# EAGLE design GBM8-1500 (EAGLE 5.10)
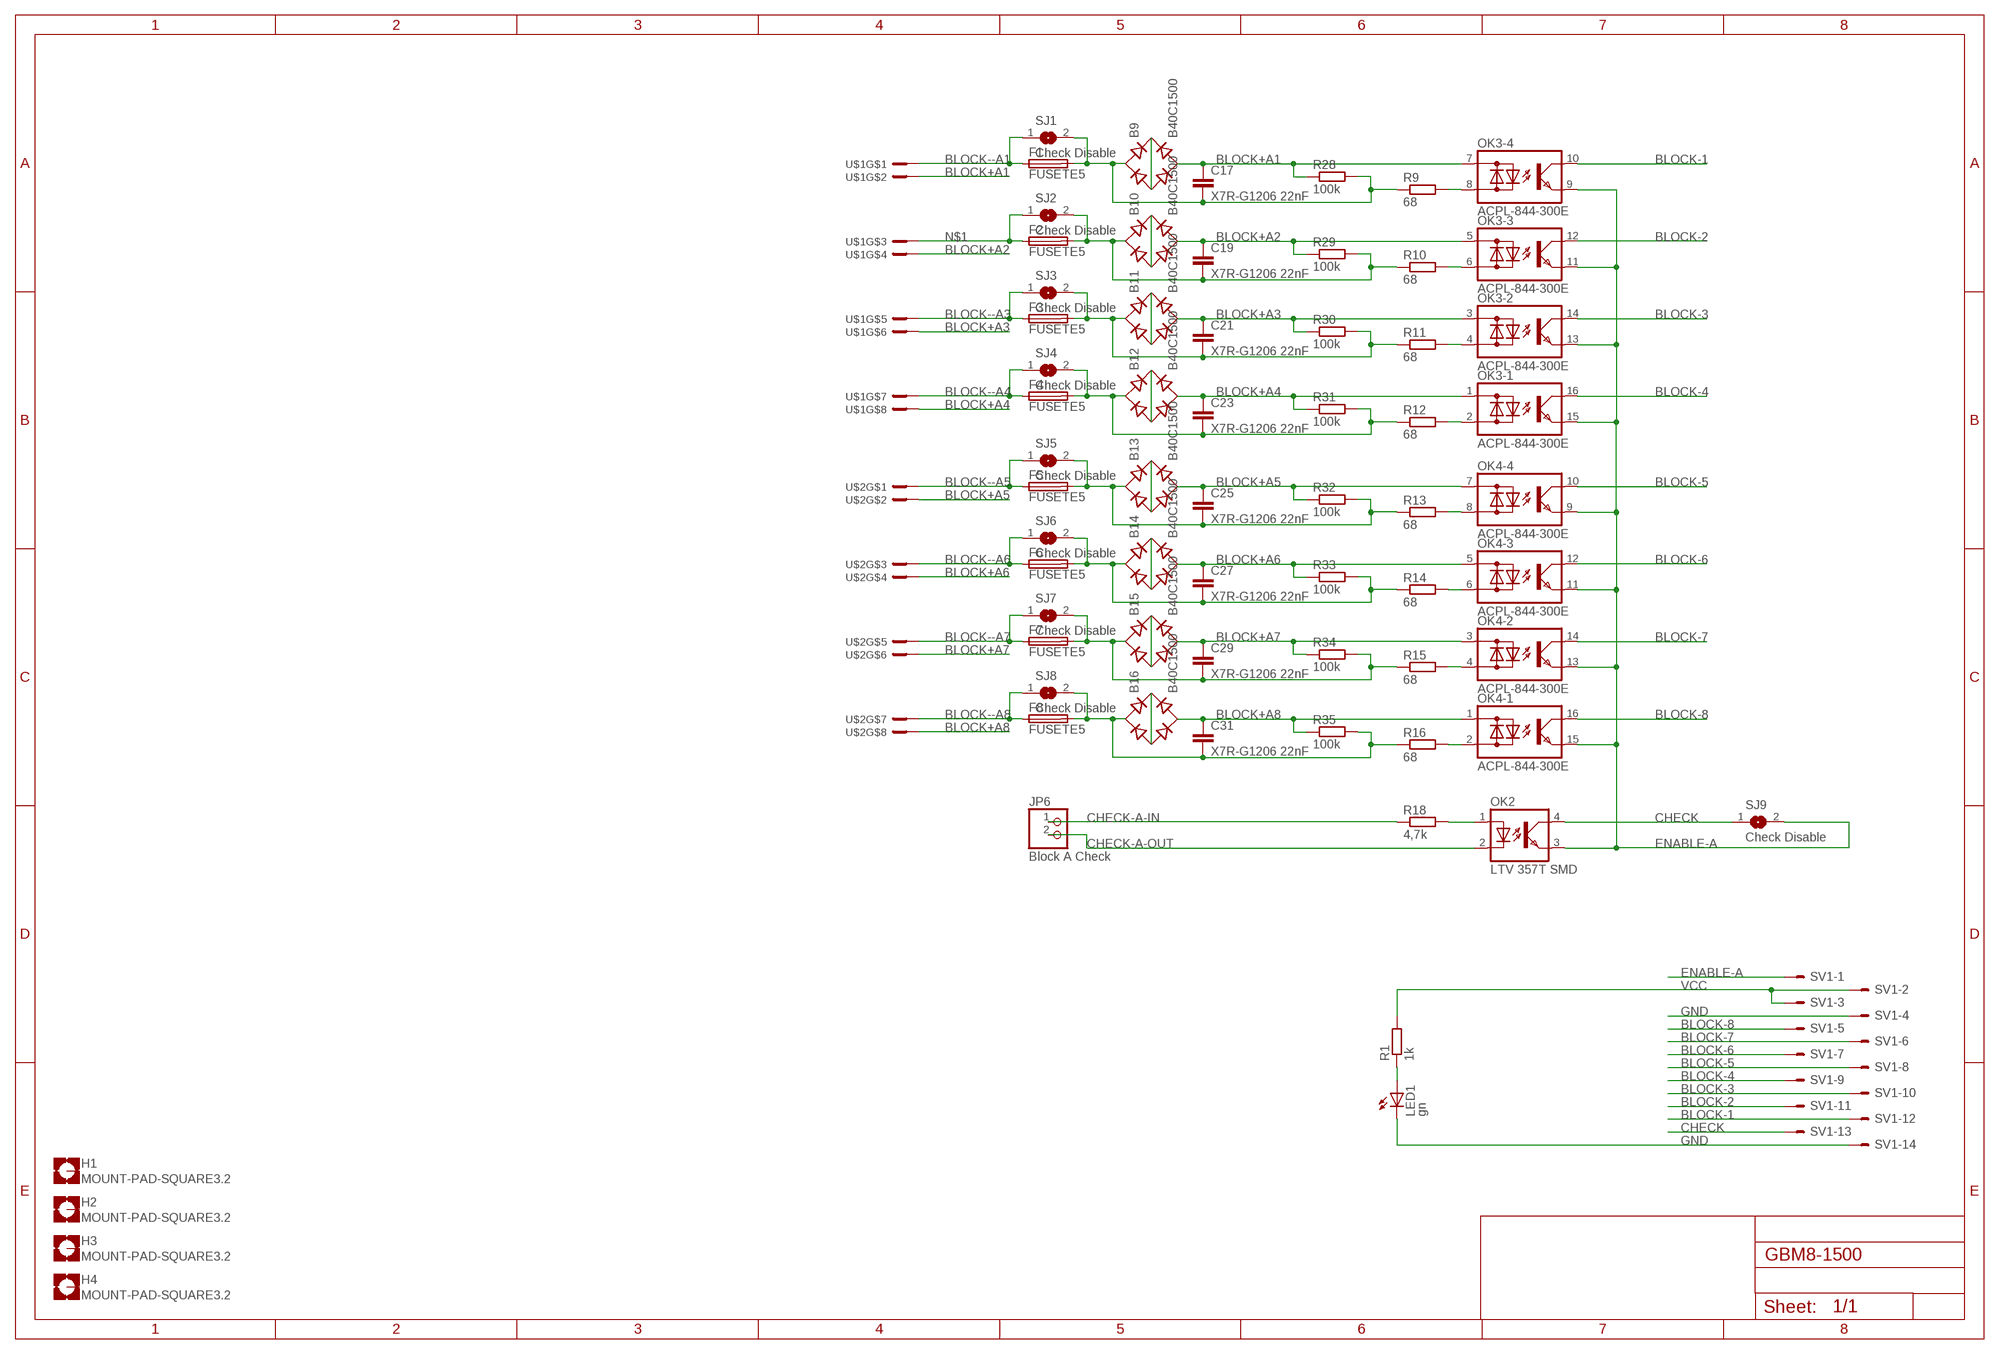
[diagram p0: schematic, sheet 1]

## Parts
B9  B40C1500  RB1A  [RB1A]
B10  B40C1500  RB1A  [RB1A]
B11  B40C1500  RB1A  [RB1A]
B12  B40C1500  RB1A  [RB1A]
B13  B40C1500  RB1A  [RB1A]
B14  B40C1500  RB1A  [RB1A]
B15  B40C1500  RB1A  [RB1A]
B16  B40C1500  RB1A  [RB1A]
C17  X7R-G1206 22nF  C-EUC1206  [C1206]
C19  X7R-G1206 22nF  C-EUC1206  [C1206]
C21  X7R-G1206 22nF  C-EUC1206  [C1206]
C23  X7R-G1206 22nF  C-EUC1206  [C1206]
C25  X7R-G1206 22nF  C-EUC1206  [C1206]
C27  X7R-G1206 22nF  C-EUC1206  [C1206]
C29  X7R-G1206 22nF  C-EUC1206  [C1206]
C31  X7R-G1206 22nF  C-EUC1206  [C1206]
F1  FUSETE5  [TE5]
F2  FUSETE5  [TE5]
F3  FUSETE5  [TE5]
F4  FUSETE5  [TE5]
F5  FUSETE5  [TE5]
F6  FUSETE5  [TE5]
F7  FUSETE5  [TE5]
F8  FUSETE5  [TE5]
H1  MOUNT-PAD-SQUARE3.2  [3,2-PAD-SQUARE]
H2  MOUNT-PAD-SQUARE3.2  [3,2-PAD-SQUARE]
H3  MOUNT-PAD-SQUARE3.2  [3,2-PAD-SQUARE]
H4  MOUNT-PAD-SQUARE3.2  [3,2-PAD-SQUARE]
JP6  Block A Check  PINHD-1X2  [1X02]
LED1  gn  LEDCHIPLED_1206  [CHIPLED_1206]
OK2  LTV 357T SMD  LTV816S  [SMD4]
OK3  ACPL-844-300E  [DIP16]
OK4  ACPL-844-300E  [DIP16]
R1  1k  R-EU_R0603  [R0603]
R9  68  R-EU_R1206  [R1206]
R10  68  R-EU_R1206  [R1206]
R11  68  R-EU_R1206  [R1206]
R12  68  R-EU_R1206  [R1206]
R13  68  R-EU_R1206  [R1206]
R14  68  R-EU_R1206  [R1206]
R15  68  R-EU_R1206  [R1206]
R16  68  R-EU_R1206  [R1206]
R18  4,7k  R-EU_R1206  [R1206]
R28  100k  R-EU_M0805  [M0805]
R29  100k  R-EU_M0805  [M0805]
R30  100k  R-EU_M0805  [M0805]
R31  100k  R-EU_M0805  [M0805]
R32  100k  R-EU_R0805  [R0805]
R33  100k  R-EU_M0805  [M0805]
R34  100k  R-EU_M0805  [M0805]
R35  100k  R-EU_M0805  [M0805]
SJ1  Check Disable  SJ  [SJ]
SJ2  Check Disable  SJ  [SJ]
SJ3  Check Disable  SJ  [SJ]
SJ4  Check Disable  SJ  [SJ]
SJ5  Check Disable  SJ  [SJ]
SJ6  Check Disable  SJ  [SJ]
SJ7  Check Disable  SJ  [SJ]
SJ8  Check Disable  SJ  [SJ]
SJ9  Check Disable  SJ  [SJ]
SV1  ML14E  [ML14]
U$1  AST021-08  [P_AST021-08]
U$2  AST021-08  [P_AST021-08]

## Nets
BLOCK+A1: B9.AC2 C17.1 OK3.7(-4:AC1) R28.1 U$1.P$2
BLOCK+A2: B10.AC2 C19.1 OK3.5(-3:AC1) R29.1 U$1.P$4
BLOCK+A3: B11.AC2 C21.1 OK3.3(-2:AC1) R30.1 U$1.P$6
BLOCK+A4: B12.AC2 C23.1 OK3.1(-1:AC1) R31.1 U$1.P$8
BLOCK+A5: B13.AC2 C25.1 OK4.7(-4:AC1) R32.1 U$2.P$2
BLOCK+A6: B14.AC2 C27.1 OK4.5(-3:AC1) R33.1 U$2.P$4
BLOCK+A7: B15.AC2 C29.1 OK4.3(-2:AC1) R34.1 U$2.P$6
BLOCK+A8: B16.AC2 C31.1 OK4.1(-1:AC1) R35.1 U$2.P$8
BLOCK-1: OK3.10(-4:C) SV1.12
BLOCK-2: OK3.12(-3:C) SV1.11
BLOCK-3: OK3.14(-2:C) SV1.10
BLOCK-4: OK3.16(-1:C) SV1.9
BLOCK-5: OK4.10(-4:C) SV1.8
BLOCK-6: OK4.12(-3:C) SV1.7
BLOCK-7: OK4.14(-2:C) SV1.6
BLOCK-8: OK4.16(-1:C) SV1.5
BLOCK--A1: F1.1 SJ1.1 U$1.P$1
BLOCK--A3: F3.1 SJ3.1 U$1.P$5
BLOCK--A4: F4.1 SJ4.1 U$1.P$7
BLOCK--A5: F5.1 SJ5.1 U$2.P$1
BLOCK--A6: F6.1 SJ6.1 U$2.P$3
BLOCK--A7: F7.1 SJ7.1 U$2.P$5
BLOCK--A8: F8.1 SJ8.1 U$2.P$7
BLOCK-A1: B9.AC1 C17.2 F1.2 R9.1 R28.2 SJ1.2
BLOCK-A2: B10.AC1 C19.2 F2.2 R10.1 R29.2 SJ2.2
BLOCK-A3: B11.AC1 C21.2 F3.2 R11.1 R30.2 SJ3.2
BLOCK-A4: B12.AC1 C23.2 F4.2 R12.1 R31.2 SJ4.2
BLOCK-A5: B13.AC1 C25.2 F5.2 R13.1 R32.2 SJ5.2
BLOCK-A6: B14.AC1 C27.2 F6.2 R14.1 R33.2 SJ6.2
BLOCK-A7: B15.AC1 C29.2 F7.2 R15.1 R34.2 SJ7.2
BLOCK-A8: B16.AC1 C31.2 F8.2 R16.1 R35.2 SJ8.2
CHECK: OK2.4(COL) SJ9.1 SV1.13
CHECK-A-IN: JP6.1 R18.1
CHECK-A-OUT: JP6.2 OK2.2(C)
ENABLE-A: OK2.3(EMIT) OK3.9(-4:E) OK3.11(-3:E) OK3.13(-2:E) OK3.15(-1:E) OK4.9(-4:E) OK4.11(-3:E) OK4.13(-2:E) OK4.15(-1:E) SJ9.2 SV1.1
GND: LED1.C SV1.4 SV1.14
N$1: F2.1 SJ2.1 U$1.P$3
N$5: LED1.A R1.1
N$7: OK2.1(A) R18.2
N$21: OK3.8(-4:AC2) R9.2
N$23: OK3.6(-3:AC2) R10.2
N$26: OK3.4(-2:AC2) R11.2
N$29: OK4.6(-3:AC2) R14.2
N$32: OK3.2(-1:AC2) R12.2
N$36: OK4.4(-2:AC2) R15.2
N$41: OK4.8(-4:AC2) R13.2
N$42: OK4.2(-1:AC2) R16.2
N$44: B9.+ B9.-
N$47: B10.+ B10.-
N$55: B11.+ B11.-
N$59: B12.+ B12.-
N$65: B13.+ B13.-
N$68: B14.+ B14.-
N$76: B15.+ B15.-
N$80: B16.+ B16.-
VCC: R1.2 SV1.2 SV1.3
Unconnected: H1.B3,2(MOUNT) H2.B3,2(MOUNT) H3.B3,2(MOUNT) H4.B3,2(MOUNT)

## Library data of the parts
B9-B16 = rectifier:RB1A: RECTIFIER 1 A
C17 C19 C21 C23 C25 C27 C29 C31 = rcl:C-EU: CAPACITOR, European symbol
F1-F8 = fuse:FUSE: Fuse
H1-H4 = holes:MOUNT-PAD-SQUARE: MOUNTING PAD, square
JP6 = pinhead:PINHD-1X2: PIN HEADER
LED1 = led:LED: LED OSRAM: - CHIPLED LG R971, LG N971, LY N971, LG Q971, LY Q971, LO R971, LY R971 LH N974, LH R974 LS Q976, LO Q976, LY Q976 LO Q996 - Hyper CHIPLED LW Q18S LB Q993, LB Q99A, LB R99A - SideLED LS A670, LO A670, LY A670, LG A670, LP A670 LB A673, LV A673, LT A673, LW A673 LH A674 LY A675 LS A676, LA A676, LO A676, LY A676, LW A676 LS A679, LY A679, LG A679 - Hyper Micro SIDELED® LS Y876, LA Y876, LO Y876, LY Y876 LT Y87S - SmartLED LW L88C, LW L88S LB L89C, LB L89S, LG L890 LS L89K, LO L89K, LY L89K LS L896, LA L896, LO L896, LY L896 - TOPLED LS T670, LO T670, LY T670, LG T670, LP T670 LSG T670, LSP T670, LSY T670, LOP T670, LYG T670 LG T671, LOG T671, LSG T671 LB T673, LV T673, LT T673, LW T673 LH T674 LS T676, LA T676, LO T676, LY T676, LB T676, LH T676, LSB T676, LW T676 LB T67C, LV T67C, LT T67C, LS T67K, LO T67K, LY T67K, LW E67C LS E67B, LA E67B, LO E67B, LY E67B, LB E67C, LV E67C, LT E67C LW T67C LS T679, LY T679, LG T679 LS T770, LO T770, LY T770, LG T770, LP T770 LB T773, LV T773, LT T773, LW T773 LH T774 LS E675, LA E675, LY E675, LS T675 LS T776, LA T776, LO T776, LY T776, LB T776 LHGB T686 LT T68C, LB T68C - Hyper Mini TOPLED® LB M676 - Mini TOPLED Santana® LG M470 LS M47K, LO M47K, LY M47K Source: http://www.osram.convergy.de LUXEON: - LUMILED® LXK2-PW12-R00, LXK2-PW12-S00, LXK2-PW14-U00, LXK2-PW14-V00 LXK2-PM12-R00, LXK2-PM12-S00, LXK2-PM14-U00 LXK2-PE12-Q00, LXK2-PE12-R00, LXK2-PE12-S00, LXK2-PE14-T00, LXK2-PE14-U00 LXK2-PB12-K00, LXK2-PB12-L00, LXK2-PB12-M00, LXK2-PB14-N00, LXK2-PB14-P00, LXK2-PB14-Q00 LXK2-PR12-L00, LXK2-PR12-M00, LXK2-PR14-Q00, LXK2-PR14-R00 LXK2-PD12-Q00, LXK2-PD12-R00, LXK2-PD12-S00 LXK2-PH12-R00, LXK2-PH12-S00 LXK2-PL12-P00, LXK2-PL12-Q00, LXK2-PL12-R00 Source: www.luxeon.com KINGBRIGHT: KA-3528ASYC Source: www.kingbright.com
OK2 = optocoupler:LTV816: OPTO COUPLER Source: LITEON, LTV816.pdf
OK3 OK4 = my-optocoupler:ACPL-844-300E: FOTOTRANSISTOR/OPTOKOPPLER ACPL-844-300E Conrad Artikel-Nr.: 140222 - 62
R1 R9-R16 R18 R28-R35 = rcl:R-EU_: RESISTOR, European symbol
SJ1-SJ9 = jumper:SJ: SMD solder JUMPER
SV1 = con-ml:ML14E: HARTING
U$1 U$2 = con-ria-ast027-750:AST021-08

## Board
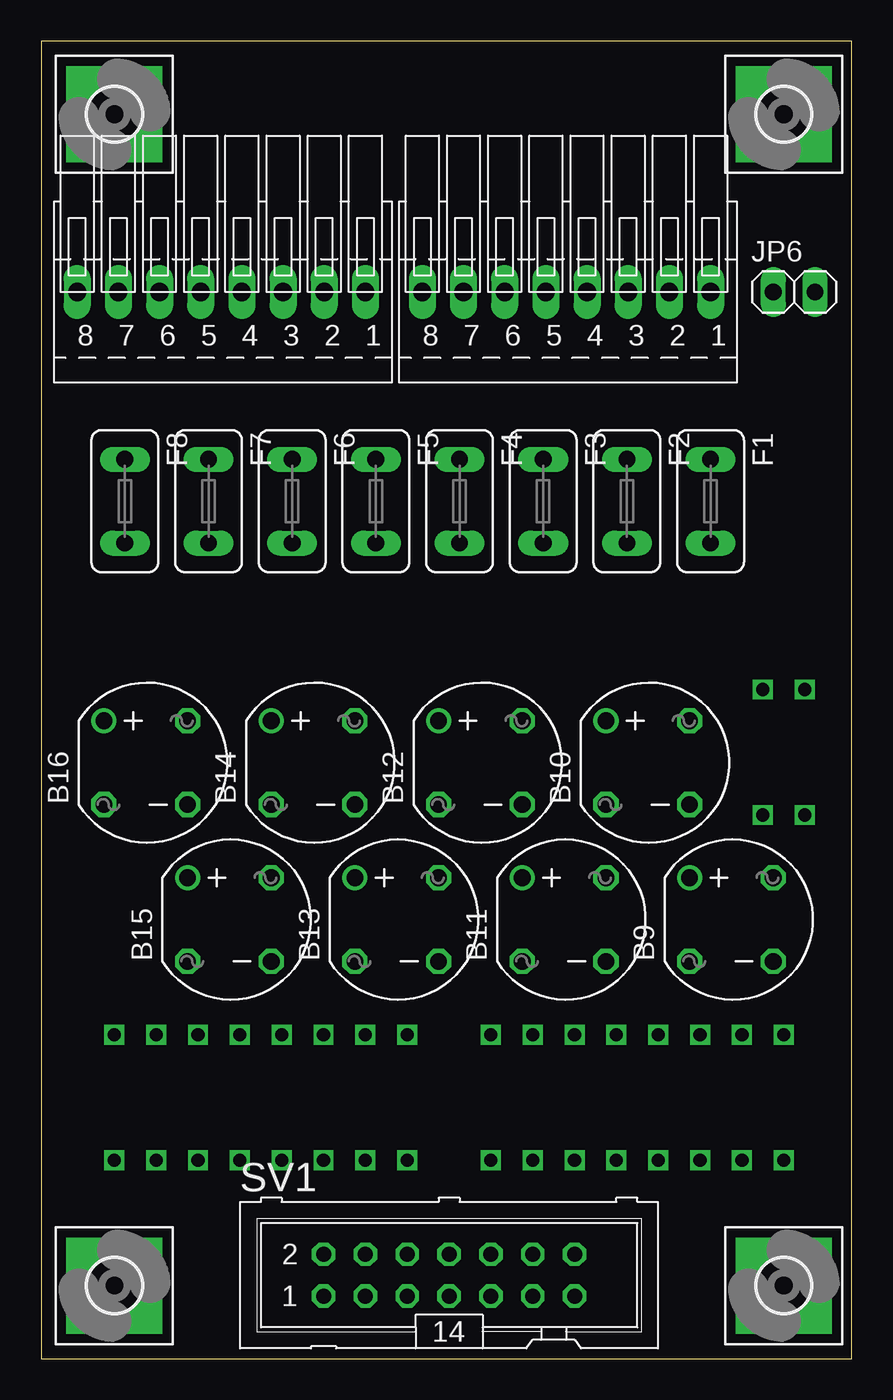
[diagram p1: board, top side]
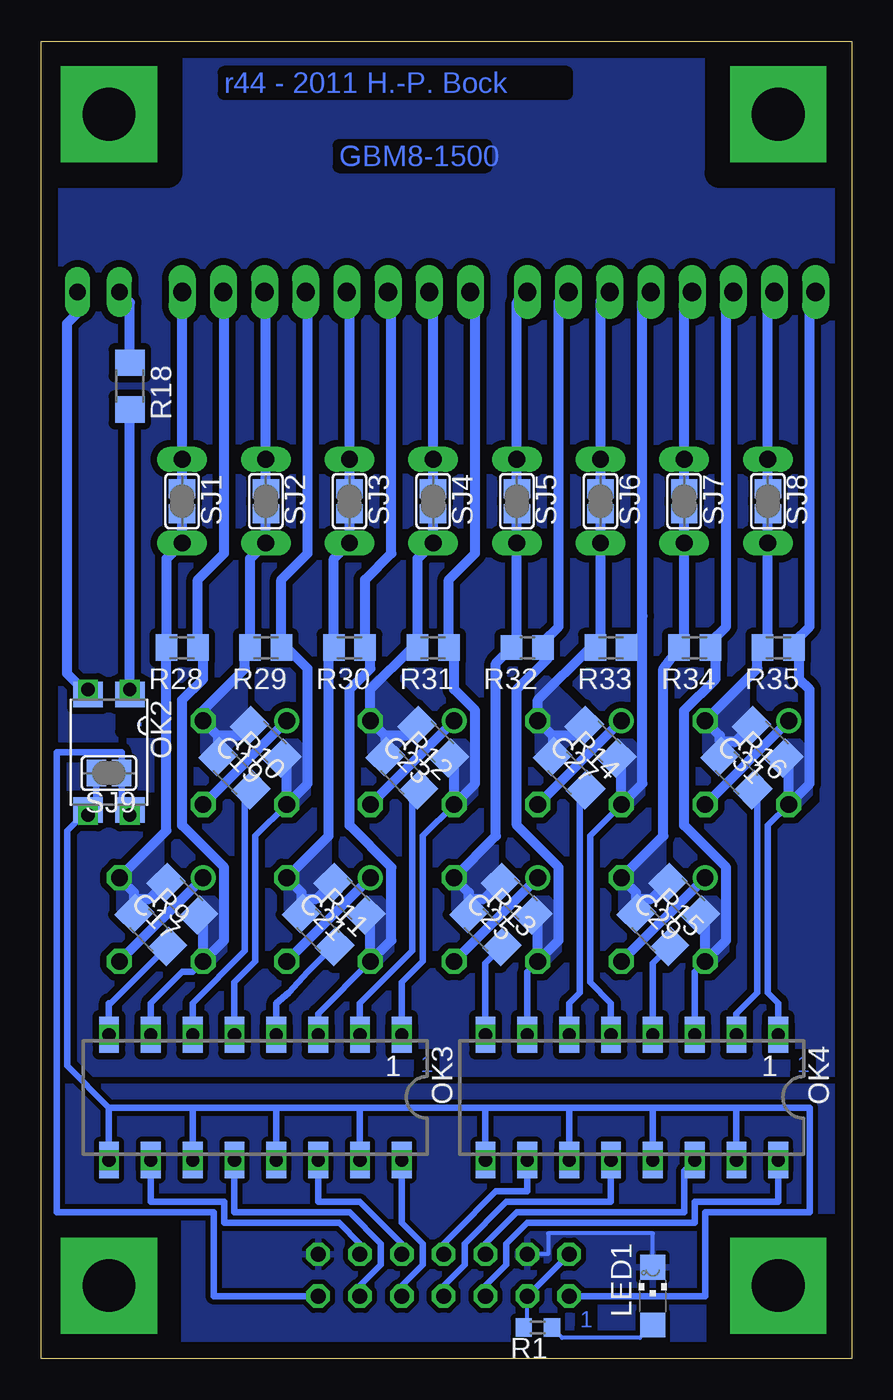
[diagram p2: board, bottom side, seen from below]

Size 49.2 x 80 mm. Coordinates in mm from the lower left corner, seen from the top.
Outline: 0,0 49.2,0 49.2,80 0,80 0,0
Copper layers (1*16): Top 0.035mm / dielectric 1.5mm / Bottom 0.035mm
Design rules "default": minimum track width 10mil, minimum drill 24mil, track to track 8mil, track to pad 8mil, pad to pad 8mil, via to via 8mil, smd to smd 8mil, copper to edge 40mil, drill to drill 8mil, minimum pad ring 10mil, minimum via ring 8mil, stop-mask expansion 4mil, vias tented up to drill 0mil, thermal gap 10mil

### Footprints (pad centres in the part's own frame; a part is rotated, then mirrored left to right if it is on the bottom)
RB1A = drill 1.016 round: + -2.54,2.54 | drill 1.016 octagon: - 2.54,-2.54; AC1 2.54,2.54; AC2 -2.54,-2.54
C1206 = smd 1.6 x 1.8: 1 -1.4,0; 2 1.4,0
TE5 = drill 1.016 long: 1 -2.54,0; 2 2.54,0
3,2-PAD-SQUARE = drill 3.2 pad 5.842 square: B3,2 0,0
1X02 = drill 1.016 long: 1 -1.27,0; 2 1.27,0
CHIPLED_1206 = smd 1.5 x 1.5: A 0,-1.75; C 0,1.75
SMD4 = smd 1.78 x 1.55: 1 -1.27,-3.5; 2 1.27,-3.5; 3 1.27,3.5; 4 -1.27,3.5
DIP16 = smd 1.2 x 2.2: 1 -8.89,-3.8; 2 -6.35,-3.8; 3 -3.81,-3.8; 4 -1.27,-3.8; 5 1.27,-3.8; 6 3.81,-3.8; 7 6.35,-3.8; 8 8.89,-3.8; 9 8.89,3.8; 10 6.35,3.8; 11 3.81,3.8; 12 1.27,3.8; 13 -1.27,3.8; 14 -3.81,3.8; 15 -6.35,3.8; 16 -8.89,3.8
R0603 = smd 1 x 1.1: 1 -0.85,0; 2 0.85,0
R1206 = smd 1.6 x 1.803: 1 -1.422,0; 2 1.422,0
M0805 = smd 1.3 x 1.6: 1 -0.95,0; 2 0.95,0
R0805 = smd 1.3 x 1.5: 1 -0.95,0; 2 0.95,0
SJ = smd 1.168 x 1.6: 1 -0.762,0; 2 0.762,0
ML14 = drill 0.914 octagon: 1 -7.62,-1.27; 2 -7.62,1.27; 3 -5.08,-1.27; 4 -5.08,1.27; 5 -2.54,-1.27; 6 -2.54,1.27; 7 0,-1.27; 8 0,1.27; 9 2.54,-1.27; 10 2.54,1.27; 11 5.08,-1.27; 12 5.08,1.27; 13 7.62,-1.27; 14 7.62,1.27
P_AST021-08 = drill 1.1 long: P$1 0,0; P$2 2.5,0; P$3 5,0; P$4 7.5,0; P$5 10,0; P$6 12.5,0; P$7 15,0; P$8 17.5,0

### Placement (x,y rotation side)
B9  41.91,26.67 0 top
B10  36.83,36.2 0 top
B11  31.75,26.67 0 top
B12  26.67,36.2 0 top
B13  21.59,26.67 0 top
B14  16.51,36.2 0 top
B15  11.43,26.67 0 top
B16  6.35,36.2 0 top
C17  40.64,27.94 135 bottom
C19  35.56,37.47 135 bottom
C21  30.48,27.94 135 bottom
C23  25.4,37.47 135 bottom
C25  20.32,27.94 135 bottom
C27  15.24,37.47 135 bottom
C29  10.16,27.94 135 bottom
C31  5.08,37.47 135 bottom
F1  40.64,52.07 270 top
F2  35.56,52.07 270 top
F3  30.48,52.07 270 top
F4  25.4,52.07 270 top
F5  20.32,52.07 270 top
F6  15.24,52.07 270 top
F7  10.16,52.07 270 top
F8  5.08,52.07 270 top
H1  4.45,75.56 0 top
H2  45.09,75.56 0 top
H3  4.45,4.45 0 top
H4  45.09,4.45 0 top
JP6  45.72,64.77 0 top
LED1  12.06,3.81 0 bottom
OK2  45.09,36.83 180 bottom
OK3  36.2,15.88 180 bottom
OK4  13.34,15.88 180 bottom
R1  19.05,1.91 180 bottom
R9  42.55,26.04 315 bottom
R10  37.47,35.56 315 bottom
R11  32.38,26.04 315 bottom
R12  27.3,35.56 315 bottom
R13  22.23,26.04 315 bottom
R14  17.14,35.56 315 bottom
R15  12.06,26.04 315 bottom
R16  6.99,35.56 315 bottom
R18  43.81,59.05 270 bottom
R28  40.64,43.18 180 bottom
R29  35.56,43.18 180 bottom
R30  30.48,43.18 180 bottom
R31  25.4,43.18 180 bottom
R32  19.68,43.18 180 bottom
R33  14.61,43.18 180 bottom
R34  9.53,43.18 180 bottom
R35  4.45,43.18 180 bottom
SJ1  40.64,52.07 270 bottom
SJ2  35.56,52.07 270 bottom
SJ3  30.48,52.07 270 bottom
SJ4  25.4,52.07 270 bottom
SJ5  20.32,52.07 270 bottom
SJ6  15.24,52.07 270 bottom
SJ7  10.16,52.07 270 bottom
SJ8  5.08,52.07 270 bottom
SJ9  45.09,35.56 180 bottom
SV1  24.77,5.08 0 top
U$1  40.64,64.77 180 top
U$2  19.68,64.77 180 top

### Tracks (layer width: path | path; a pad name or v marks a point on that pad's centre or on a via)
BLOCK+A1  (via drill 0.8)
  Bottom 0.406: B9.AC2 40.01,23.5 40.64,23.5 42.55,21.59 OK3.7 | 39.37,42.86 R28.1
  Bottom 0.6: C17.1 39.37,26.67 B9.AC2 38.1,25.4 38.1,29.84 40.64,32.38 40.64,40.01 39.37,41.27
  Bottom 0.61: 39.37,41.27 39.37,42.86 | R28.1 39.69,47.3 38.1,48.9 38.1,64.73 U$1.P$2
  other vias: 42.55,19.68
  pour Bottom (isolate 0.254, no thermals): 39.37,23.5 38.1,24.77 38.1,27.3 38.73,27.94 39.37,27.94
BLOCK+A2  (via drill 0.8)
  Bottom 0.406: B10.AC2 36.2,31.75 36.2,24.13 37.47,22.86 OK3.5 | 34.29,43.18 R29.1
  Bottom 0.6: C19.1 34.29,36.2 B10.AC2 33.02,34.92 33.02,41.91 34.29,43.18
  Bottom 0.61: R29.1 34.61,47.3 33.02,48.9 33.02,64.65 U$1.P$4
  other vias: 37.47,19.68
  pour Bottom (isolate 0.254, no thermals): 34.29,33.02 33.02,34.29 33.02,36.83 33.66,37.47 34.29,37.47
BLOCK+A3  (via drill 0.8)
  Bottom 0.406: B11.AC2 32.38,20.95 OK3.3
  Bottom 0.6: C21.1 29.21,26.67 B11.AC2 27.94,25.4 27.94,29.84 30.48,32.38 30.48,40.64 29.21,41.91
  Bottom 0.61: 29.21,41.91 29.21,42.86 R30.1 29.53,47.3 27.94,48.9 27.94,64.57 U$1.P$6
  other vias: 32.38,19.68
  pour Bottom (isolate 0.254, no thermals): 29.21,23.5 27.94,24.77 27.94,27.3 28.57,27.94 29.21,27.94
BLOCK+A4  (via drill 0.8)
  Bottom 0.406: B12.AC2 26.04,31.75 26.04,24.13 27.3,22.86 OK3.1
  Bottom 0.6: C23.1 24.13,36.2 B12.AC2 22.86,34.92 22.86,39.37 24.13,40.64
  Bottom 0.61: 24.13,40.64 24.13,42.86 R31.1 24.45,47.3 22.86,48.9 22.86,64.49 U$1.P$8
  other vias: 27.3,19.68
  pour Bottom (isolate 0.254, no thermals): 24.13,33.02 22.86,34.29 22.86,36.83 23.5,37.47 24.13,37.47
BLOCK+A5  (via drill 0.8)
  Bottom 0.406: B13.AC2 19.68,23.5 v19.68,19.68 | 18.41,42.55 18.41,42.86
  Bottom 0.6: C25.1 19.05,26.67 B13.AC2 17.78,25.4 17.78,29.84 20.32,32.38 20.32,40.64 18.41,42.55
  Bottom 0.61: 18.41,42.86 R32.1 18.73,43.49 17.78,44.45 17.78,64.17 U$2.P$2
  pour Bottom (isolate 0.254, no thermals): 19.05,23.5 17.78,24.77 17.78,27.3 18.41,27.94 19.05,27.94
BLOCK+A6  (via drill 0.8)
  Bottom 0.406: OK4.5 14.61,21.59 15.88,22.86 15.88,31.75 B14.AC2 | 12.7,45.09 12.7,44.13 R33.1
  Bottom 0.6: C27.1 13.97,36.2 B14.AC2 12.7,34.92 12.7,45.09
  Bottom 0.61: 12.7,45.09 12.7,64.25 U$2.P$4
  other vias: 14.61,19.68
  pour Bottom (isolate 0.254, no thermals): 13.97,33.02 12.7,34.29 12.7,36.83 13.34,37.47 13.97,37.47
BLOCK+A7  (via drill 0.8)
  Bottom 0.406: B15.AC2 9.53,23.5 OK4.3 | 8.26,42.86 R34.1
  Bottom 0.6: C29.1 8.89,26.67 B15.AC2 7.62,25.4 7.62,29.84 10.16,32.38 10.16,39.37 8.26,41.27
  Bottom 0.61: 8.26,41.27 8.26,42.86 | R34.1 8.57,43.49 7.62,44.45 7.62,64.33 U$2.P$6
  other vias: 9.53,19.68
  pour Bottom (isolate 0.254, no thermals): 8.89,23.5 7.62,24.77 7.62,27.3 8.26,27.94 8.89,27.94
BLOCK+A8  (via drill 0.8)
  Bottom 0.406: OK4.1 4.45,21.59 5.08,22.23 5.08,32.38 B16.AC2 | 3.17,42.86 R35.1
  Bottom 0.6: C31.1 3.81,36.2 B16.AC2 2.54,34.92 2.54,40.64 3.17,41.27
  Bottom 0.61: 3.17,41.27 3.17,42.86 | R35.1 3.5,43.49 2.54,44.45 2.54,64.42 U$2.P$8
  other vias: 4.45,19.68
  pour Bottom (isolate 0.254, no thermals): 3.81,33.02 2.54,34.29 2.54,36.83 3.17,37.47 3.81,37.47
BLOCK-1  (via drill 0.8)
  Bottom 0.406: SV1.12 29.84,6.99 31.11,8.26 38.1,8.26 38.1,9.53 42.55,9.53 v42.55,12.06 OK3.10
BLOCK-2  (via drill 0.8)
  Bottom 0.406: SV1.11 29.84,4.45 28.57,5.71 28.57,6.99 30.48,8.89 37.47,8.89 v37.47,12.06 OK3.12
BLOCK-3  (via drill 0.8)
  Bottom 0.406: SV1.10 27.3,6.99 29.84,9.53 32.38,9.53 v32.38,12.06 OK3.14
BLOCK-4  (via drill 0.8)
  Bottom 0.406: SV1.9 27.3,4.45 26.04,5.71 26.04,6.99 27.3,8.26 v27.3,12.06 OK3.16
BLOCK-5  (via drill 0.8)
  Bottom 0.406: SV1.8 24.77,6.99 24.13,7.62 21.59,10.16 19.68,10.16 v19.68,12.06 OK4.10
BLOCK-6  (via drill 0.8)
  Bottom 0.406: SV1.7 24.77,4.45 23.5,5.71 23.5,6.99 20.95,9.53 14.61,9.53 v14.61,12.06 OK4.12
BLOCK-7  (via drill 0.8)
  Bottom 0.406: OK4.14 v9.53,12.06 10.16,11.43 10.16,8.89 20.32,8.89 21.59,7.62 22.23,6.99 SV1.6
BLOCK-8  (via drill 0.8)
  Bottom 0.406: OK4.16 v4.45,12.06 4.45,9.53 9.53,9.53 9.53,8.26 19.68,8.26 20.32,7.62 20.95,6.99 20.95,5.71 22.23,4.45 SV1.5
BLOCK--A1
  Bottom 0.61: U$1.P$1 F1.1 SJ1.1
BLOCK--A3
  Bottom 0.61: U$1.P$5 30.48,64.61 F3.1 SJ3.1
BLOCK--A4
  Bottom 0.61: U$1.P$7 25.4,64.53 F4.1 SJ4.1
BLOCK--A5
  Bottom 0.61: U$2.P$1 20.32,64.14 F5.1 SJ5.1
BLOCK--A6
  Bottom 0.61: U$2.P$3 15.24,64.22 F6.1 SJ6.1
BLOCK--A7
  Bottom 0.61: U$2.P$5 10.16,64.3 F7.1 SJ7.1
BLOCK--A8
  Bottom 0.61: U$2.P$7 5.08,64.38 F8.1 SJ8.1
BLOCK-A1
  Bottom 0.406: R28.2 41.91,43.5
  Bottom 0.6: R9.1 43.55,27.94 | 43.55,27.94 43.55,28.31 B9.AC1 41.59,32.07 | C17.2 42.62,27.94 43.55,27.94
  Bottom 0.61: 41.59,32.07 R28.2 41.59,48.58 F1.2 SJ1.2 40.64,51.44
  pour Bottom (isolate 0.254, no thermals): 41.27,29.21 43.81,26.67 44.45,27.3 44.45,29.21 41.91,31.75 41.91,29.84
BLOCK-A2
  Bottom 0.406: 36.83,42.86 R29.2
  Bottom 0.6: 38.47,37.84 B10.AC1 39.37,39.37 36.83,41.91 36.83,42.86 | 38.47,37.84 R10.1 | C19.2 37.17,37.84 38.47,37.84
  Bottom 0.61: R29.2 36.51,48.58 F2.2 SJ2.2
  pour Bottom (isolate 0.254, no thermals): 36.2,38.73 38.73,36.2 39.37,36.83 39.37,38.73 36.83,41.27 36.83,39.37
BLOCK-A3
  Bottom 0.6: R11.1 33.39,27.94 | 33.39,27.94 33.39,28.31 B11.AC1 31.75,31.75 | C21.2 32.46,27.94 33.39,27.94
  Bottom 0.61: 31.75,31.75 31.75,42.86 R30.2 31.43,48.58 F3.2 SJ3.2
  pour Bottom (isolate 0.254, no thermals): 31.11,29.21 33.66,26.67 34.29,27.3 34.29,29.21 31.75,31.75 31.75,29.84
BLOCK-A4
  Bottom 0.6: 28.31,37.84 B12.AC1 29.21,40.64 26.67,43.18 | 28.31,37.84 R12.1 | C23.2 27.01,37.84 28.31,37.84
  Bottom 0.61: 26.67,43.18 R31.2 26.35,48.58 F4.2 SJ4.2
  pour Bottom (isolate 0.254, no thermals): 26.04,38.73 28.57,36.2 29.21,36.83 29.21,41.91
BLOCK-A5
  Bottom 0.6: R13.1 23.23,27.94 | 23.23,27.94 23.23,28.31 B13.AC1 21.59,31.75 21.59,41.27 | C25.2 22.3,27.94 23.23,27.94
  Bottom 0.61: 21.59,41.27 21.59,42.23 R32.2 20.32,43.49 F5.2 SJ5.2
  pour Bottom (isolate 0.254, no thermals): 20.95,29.21 23.5,26.67 24.13,27.3 24.13,29.21 21.59,31.11 21.59,29.84
BLOCK-A6
  Bottom 0.6: 18.15,37.84 B14.AC1 19.05,40.01 | 18.15,37.84 R14.1 | C27.2 16.85,37.84 18.15,37.84
  Bottom 0.61: 19.05,40.01 15.88,43.18 R33.2 15.24,43.49 F6.2 SJ6.2
  pour Bottom (isolate 0.254, no thermals): 15.88,38.73 18.41,36.2 19.05,36.83 19.05,41.91
BLOCK-A7
  Bottom 0.6: R15.1 13.07,27.94 | 13.07,27.94 13.07,28.31 B15.AC1 11.43,31.75 11.43,41.91 | C29.2 12.14,27.94 13.07,27.94
  Bottom 0.61: 11.43,41.91 R34.2 10.16,43.49 F7.2 SJ7.2
  pour Bottom (isolate 0.254, no thermals): 10.79,29.21 13.34,26.67 13.97,27.3 13.97,29.21 11.43,31.75 11.43,29.84
BLOCK-A8
  Bottom 0.406: 5.71,42.86 R35.2
  Bottom 0.6: 7.99,37.47 R16.1 | 7.99,37.47 7.99,37.84 B16.AC1 5.71,41.91 | C31.2 7.06,37.47 7.99,37.47
  Bottom 0.61: 5.71,41.91 5.71,42.86 | R35.2 5.08,43.49 F8.2 SJ8.2
  pour Bottom (isolate 0.254, no thermals): 5.71,38.73 8.26,36.2 8.89,36.83 8.89,38.73 6.35,41.27 6.35,39.37
CHECK
  Bottom 0.406: OK2.4 44.32,33.33 SJ9.1 44.32,36.83 48.26,36.83 48.26,8.89 38.73,8.89 38.73,3.81 SV1.13
CHECK-A-IN
  Bottom 0.61: R18.1 43.81,64.14 JP6.1
CHECK-A-OUT
  Bottom 0.61: JP6.2 46.99,63.5 47.62,62.87 47.62,41.6 OK2.2
ENABLE-A
  Bottom 0.406: 6.99,15.24 OK4.15 | 12.06,15.24 OK4.13 | 17.14,15.24 OK4.11 | 12.06,15.24 17.14,15.24 | 22.23,15.24 OK4.9 | 17.14,15.24 22.23,15.24 | 22.23,15.24 29.84,15.24 | 29.84,15.24 OK3.15 | 45.09,15.24 OK3.9 | 29.84,15.24 34.92,15.24 | 34.92,15.24 40.01,15.24 | 40.01,15.24 45.09,15.24 | 40.01,15.24 OK3.11 | 34.92,15.24 OK3.13 | 6.99,15.24 12.06,15.24 | SV1.1 8.89,3.81 8.89,8.89 2.54,8.89 2.54,15.24 6.99,15.24 | 45.09,15.24 47.62,17.78 47.62,32.06 OK2.3 45.85,33.33 SJ9.2
GND
  Bottom 0.254: SV1.4 18.41,6.35 18.41,7.62 12.06,7.62 LED1.C
  pour Bottom (isolate 0.3, rank 2): 0,0 48.9,0 48.9,16.51 0,16.51
N$1
  Bottom 0.61: U$1.P$3 35.56,64.69 F2.1 SJ2.1
N$2  (via drill 0.8)
  other vias: 22.23,12.06
N$3  (via drill 0.8)
  other vias: 17.14,12.06
N$4  (via drill 0.8)
  other vias: 12.06,12.06
N$5
  Bottom 0.254: LED1.A 12.86,1.27 17.57,1.27 R1.1
N$6  (via drill 0.8)
  other vias: 6.99,12.06
N$7  (via drill 0.8)
  Bottom 0.61: OK2.1 v43.81,40.64 R18.2
N$8  (via drill 0.8)
  other vias: 45.09,12.06
N$9  (via drill 0.8)
  other vias: 40.01,12.06
N$10  (via drill 0.8)
  other vias: 34.92,12.06
N$11  (via drill 0.8)
  other vias: 29.84,12.06
N$12  (via drill 0.8)
  other vias: 46.35,40.64
N$13  (via drill 0.8)
  other vias: 46.35,33.02
N$14  (via drill 0.8)
  other vias: 43.81,33.02
N$21  (via drill 0.8)
  Bottom 0.406: R9.2 44.98,21.59 45.09,21.59 OK3.8
  other vias: 45.09,19.68
N$22
  pour Bottom (isolate 0.4, rank 6): 0,17.14 48.9,17.14 48.9,80.01 0,80.01
N$23  (via drill 0.8)
  Bottom 0.406: R10.2 36.83,34.18 36.83,24.77 40.01,21.59 OK3.6
  other vias: 40.01,19.68
N$26  (via drill 0.8)
  Bottom 0.406: R11.2 31.11,25.4 33.02,23.5 34.18,22.23 34.92,21.59 OK3.4
  other vias: 34.92,19.68
N$29  (via drill 0.8)
  Bottom 0.406: R14.2 16.51,34.18 16.51,22.23 17.14,21.59 OK4.6
  other vias: 17.14,19.68
N$32  (via drill 0.8)
  Bottom 0.406: R12.2 26.67,34.18 26.67,24.77 29.84,21.59 OK3.2
  other vias: 29.84,19.68
N$36  (via drill 0.8)
  Bottom 0.406: R15.2 12.06,24.02 v12.06,19.68
N$41  (via drill 0.8)
  Bottom 0.406: R13.2 22.23,24.02 OK4.8
  other vias: 22.23,19.68
N$42  (via drill 0.8)
  Bottom 0.406: R16.2 5.71,34.82 5.71,22.23 6.99,20.95 OK4.2
  other vias: 6.99,19.68
N$44
  Bottom 0.6: B9.+ B9.-
N$47
  Bottom 0.6: B10.+ B10.-
N$55
  Bottom 0.6: B11.+ B11.-
N$59
  Bottom 0.6: B12.+ B12.-
N$65
  Bottom 0.6: B13.+ B13.-
N$68
  Bottom 0.6: B14.+ B14.-
N$76
  Bottom 0.6: B15.+ B15.-
N$80
  Bottom 0.6: B16.+ B16.-
VCC
  Bottom 0.254: R1.2 19.68,1.91 SV1.3
  Bottom 0.406: SV1.3 SV1.2

### Text on the board
Bottom: r44 - 2011 H.-P. Bock | GBM8-1500 | · | 1 | 1 | 1